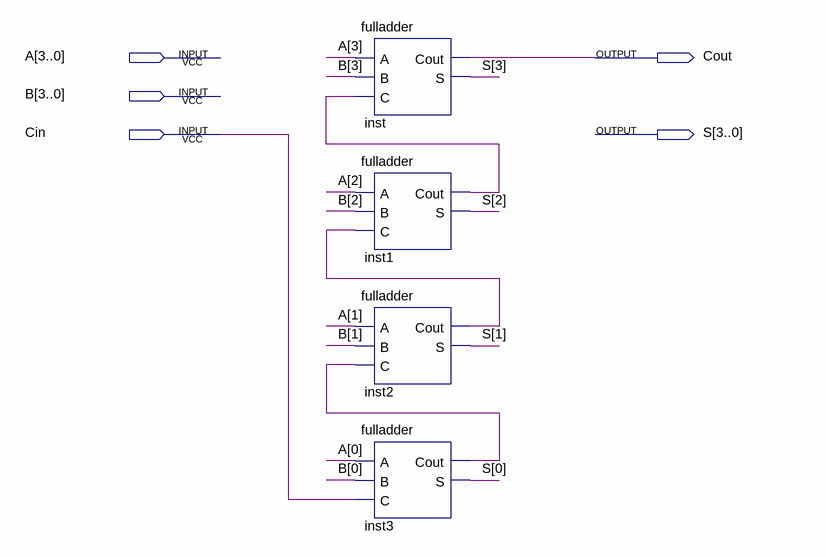
[diagram p0: schematic sheet]
// Quartus schematic adder4.bdf as structural Verilog: 4 symbols, 5 pins
module adder4 (
  input  [3:0] A,
  input  [3:0] B,
  input  Cin,
  output Cout,
  output [3:0] S
);

  wire inst1_cout, inst2_cout, inst3_cout;

  fulladder inst (.A(A[3]), .B(B[3]), .C(inst1_cout), .Cout(Cout), .S(S[3]));
  fulladder inst1 (.A(A[2]), .B(B[2]), .C(inst2_cout), .Cout(inst1_cout), .S(S[2]));
  fulladder inst2 (.A(A[1]), .B(B[1]), .C(inst3_cout), .Cout(inst2_cout), .S(S[1]));
  fulladder inst3 (.A(A[0]), .B(B[0]), .C(Cin), .Cout(inst3_cout), .S(S[0]));
endmodule
